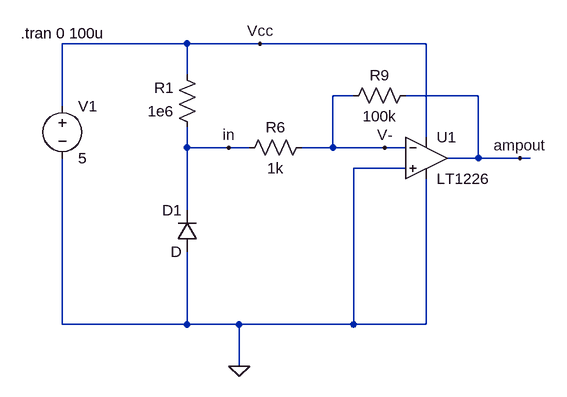
[diagram p0: schematic laserOpAmp1226.asc]
laserOpAmp1226.asc, the LTspice schematic file:
Version 4
SHEET 1 880 688
WIRE -96 176 -288 176
WIRE 16 176 -96 176
WIRE 272 176 16 176
WIRE -96 224 -96 176
WIRE 160 256 128 256
WIRE 352 256 240 256
WIRE -288 272 -288 176
WIRE 272 320 272 176
WIRE -96 336 -96 304
WIRE -32 336 -96 336
WIRE 0 336 -32 336
WIRE 128 336 128 256
WIRE 128 336 80 336
WIRE 208 336 128 336
WIRE 240 336 208 336
WIRE 352 352 352 256
WIRE 352 352 304 352
WIRE 416 352 352 352
WIRE 432 352 416 352
WIRE 240 368 160 368
WIRE -96 432 -96 336
WIRE -288 608 -288 352
WIRE -96 608 -96 496
WIRE -96 608 -288 608
WIRE -16 608 -96 608
WIRE 160 608 160 368
WIRE 160 608 -16 608
WIRE 272 608 272 384
WIRE 272 608 160 608
WIRE -16 672 -16 608
FLAG -16 672 0
FLAG -32 336 in
FLAG 16 176 Vcc
FLAG 416 352 ampout
FLAG 208 336 V-
SYMBOL voltage -288 256 R0
SYMATTR InstName V1
SYMATTR Value 5
SYMBOL Opamps/LT1226 272 288 R0
SYMATTR InstName U1
SYMBOL res 256 240 R90
WINDOW 0 0 56 VBottom 2
WINDOW 3 32 56 VTop 2
SYMATTR InstName R9
SYMATTR Value 100k
SYMBOL res 96 320 R90
WINDOW 0 0 56 VBottom 2
WINDOW 3 32 56 VTop 2
SYMATTR InstName R6
SYMATTR Value 1k
SYMBOL res -80 320 R180
WINDOW 0 36 76 Left 2
WINDOW 3 36 40 Left 2
SYMATTR InstName R1
SYMATTR Value 1e6
SYMBOL diode -80 496 R180
WINDOW 0 24 64 Left 2
WINDOW 3 24 0 Left 2
SYMATTR InstName D1
TEXT -352 160 Left 2 !.tran 0 100u

The netlist it stands for:
* laserOpAmp1226.asc
V1 Vcc 0 5
XU1 0 V- Vcc 0 ampout LT1226  ; pins In+ In- V+ V- OUT
R9 ampout V- 100k
R6 V- in 1k
R1 in Vcc 1e6
D1 0 in D
.model D D
.lib standard.dio
.tran 0 100u
.backanno
.end